# Altium project Power transfer.PrjPcb
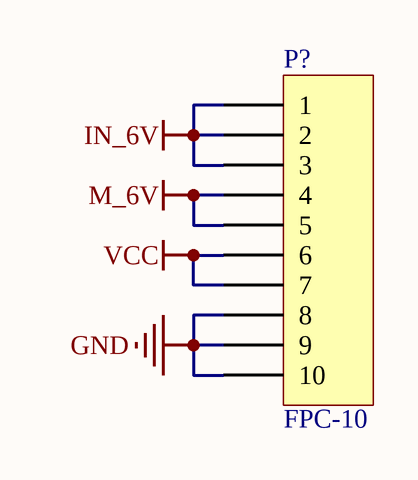
[diagram p0: Power transfer.SchDoc]
1 sheet, 1 parts. Net scope: global (net labels, ports and power ports of the same name join across sheets).
Board file: Power transfer.PcbDoc

## Sheet Power transfer.SchDoc
size A4

### Parts
P?  FPC-10  [FPC-10]

### Nets
GND: P?.8 P?.9 P?.10
IN_6V: P?.1 P?.2 P?.3
M_6V: P?.4 P?.5
VCC: P?.6 P?.7

### Notes on the sheet
- 集大电协
- 项目名称
- 日    期
- 图    号
- 版    本
- 型    号
- 制    图
- 审    核

### Library data of the parts
P? = FPC-10: 软排线底座